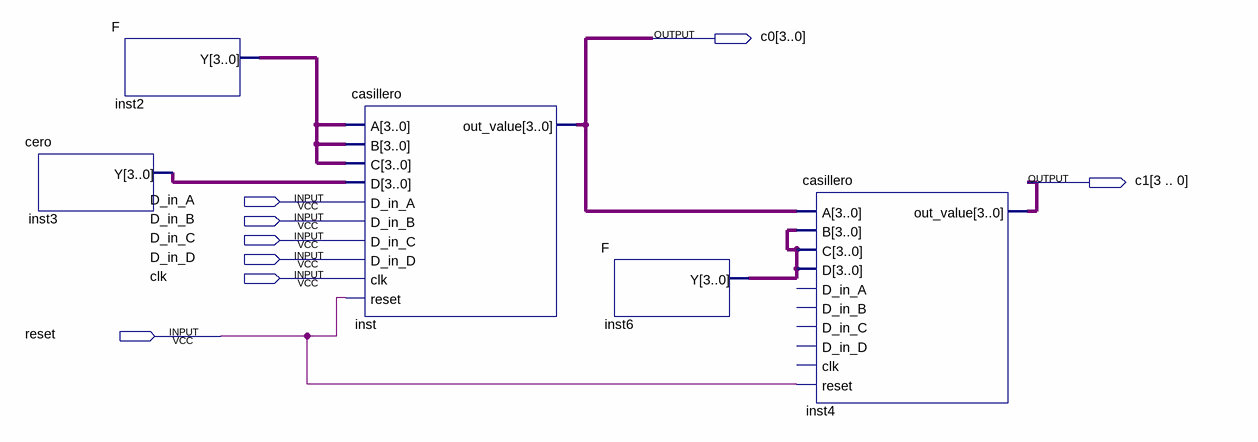
[diagram p0: schematic sheet]
// Quartus schematic pru.bdf as structural Verilog: 5 symbols, 8 pins
module pru (
  input  D_in_A,
  input  D_in_B,
  input  D_in_C,
  input  D_in_D,
  input  clk,
  input  reset,
  output [3:0] c0,
  output [3:0] c1
);

  wire [3:0] inst2_y, inst3_y, inst6_y;

  cero inst3 (.Y(inst3_y));
  F inst2 (.Y(inst2_y));
  casillero inst (
    .A(inst2_y), .B(inst2_y), .C(inst2_y), .D(inst3_y), .D_in_A(D_in_A), .D_in_B(D_in_B), .D_in_C(D_in_C),
    .D_in_D(D_in_D), .clk(clk), .reset(reset), .out_value(c0));
  F inst6 (.Y(inst6_y));
  casillero inst4 (
    .A(c0), .B(inst6_y), .C(inst6_y), .D(inst6_y), .reset(reset), .out_value(c1));  // open: D_in_A, D_in_B, D_in_C, D_in_D, clk
endmodule
